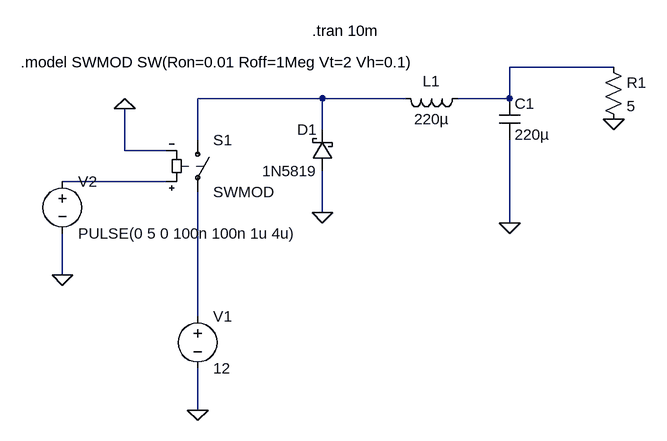
[diagram p0: schematic PWM_Buck_Convertor_Sim.asc]
PWM_Buck_Convertor_Sim.asc, the LTspice schematic file:
Version 4.1
SHEET 1 880 680
WIRE 720 -256 560 -256
WIRE 272 -208 80 -208
WIRE 400 -208 272 -208
WIRE 560 -208 560 -256
WIRE 560 -208 480 -208
WIRE 272 -160 272 -208
WIRE 80 -144 80 -208
WIRE -32 -128 -32 -192
WIRE 32 -128 -32 -128
WIRE 32 -80 -128 -80
WIRE 272 -32 272 -96
WIRE 560 -16 560 -144
WIRE -128 64 -128 0
WIRE 80 128 80 -64
WIRE 80 272 80 208
FLAG 80 272 0
FLAG 560 -16 0
FLAG 272 -32 0
FLAG 720 -176 0
FLAG -128 64 0
FLAG -32 -192 0
SYMBOL voltage 80 112 R0
WINDOW 123 0 0 Left 0
WINDOW 39 0 0 Left 0
SYMATTR InstName V1
SYMATTR Value 12
SYMBOL sw 80 -160 R0
SYMATTR InstName S1
SYMATTR Value SWMOD
SYMBOL ind 496 -224 R90
WINDOW 0 5 56 VBottom 2
WINDOW 3 32 56 VTop 2
SYMATTR InstName L1
SYMATTR Value 220µ
SYMATTR SpiceLine Rser=1m
SYMBOL cap 544 -208 R0
SYMATTR InstName C1
SYMATTR Value 220µ
SYMBOL schottky 288 -96 R180
WINDOW 0 24 64 Left 2
WINDOW 3 24 0 Left 2
SYMATTR InstName D1
SYMATTR Value 1N5819
SYMATTR Description Diode
SYMATTR Type diode
SYMBOL res 704 -272 R0
SYMATTR InstName R1
SYMATTR Value 5
SYMBOL voltage -128 -96 R0
WINDOW 123 0 0 Left 0
WINDOW 39 0 0 Left 0
SYMATTR InstName V2
SYMATTR Value PULSE(0 5 0 100n 100n 1u 4u)
TEXT -192 -264 Left 2 !.model SWMOD SW(Ron=0.01 Roff=1Meg Vt=2 Vh=0.1)
TEXT 256 -312 Left 2 !.tran 10m

The netlist it stands for:
* PWM_Buck_Convertor_Sim.asc
V1 N004 0 12
S1 N002 N004 N003 0 SWMOD
L1 N001 N002 220µ Rser=1m
C1 N001 0 220µ
D1 0 N002 1N5819
R1 N001 0 5
V2 N003 0 PULSE(0 5 0 100n 100n 1u 4u)
.model D D
.lib standard.dio
.model SWMOD SW(Ron=0.01 Roff=1Meg Vt=2 Vh=0.1)
.tran 10m
.backanno
.end